# Altium schematic sheet 400W_dualConverter.SchDoc
size A4
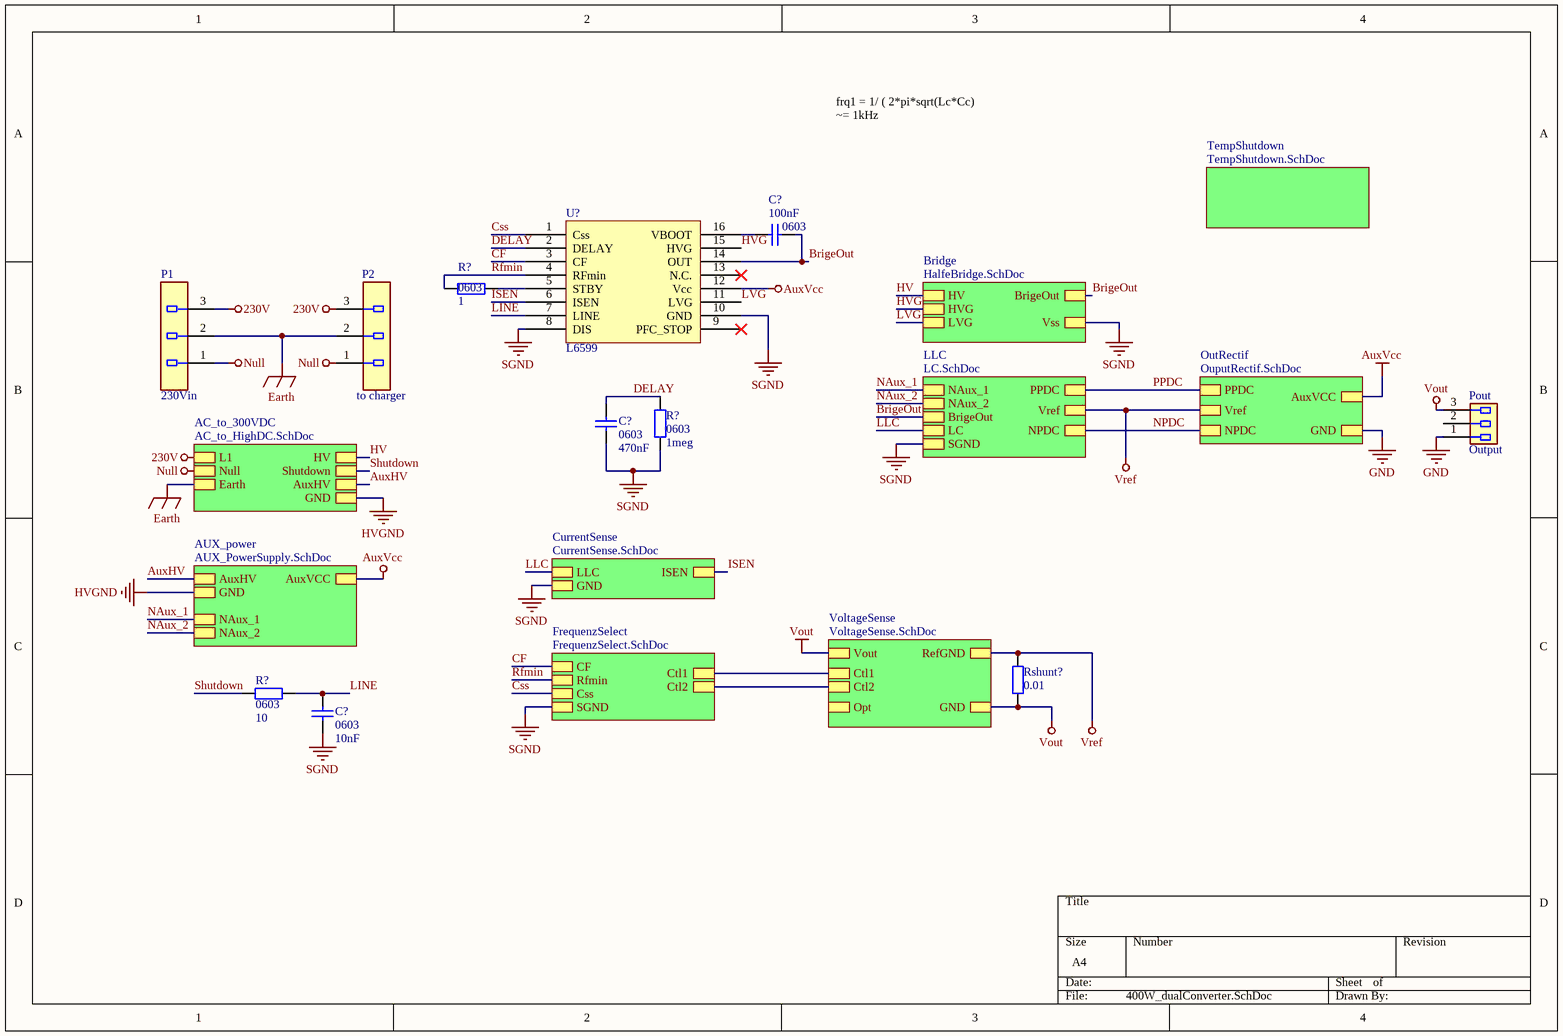
[diagram p0: 400W_dualConverter.SchDoc]

## Parts
(Parts that share a designator on the sheet are numbered #1, #2 ... from top to bottom, then left to right.)
C?#1  0603  value 100nF  [1608[0603]]
C?#2  0603  value 470nF  [1608[0603]]
C?#3  0603  value 10nF  [1608[0603]]
P1  230Vin  [IEC C14]
P2  to charger  [IEC C13 FM]
Pout  Output  [3pin, 5.08 terminal connector]
R?#1  0603  value 1  [1608[0603]]
R?#2  0603  value 1meg  [1608[0603]]
R?#3  0603  value 10  [1608[0603]]
Rshunt?  value 0.01  [1608[0603]]  (hidden comment: Res2)
U?  L6599  [SOP127P600X175-16N]

## Sub-sheets
AC_to_300VDC = AC_to_HighDC.SchDoc: L1, Null, Shutdown, HV, Earth, AuxHV, GND
AUX_power = AUX_PowerSupply.SchDoc: AuxHV, GND, NAux_1, NAux_2, AuxVCC
Bridge = HalfeBridge.SchDoc: HV, HVG, LVG, Vss, BrigeOut
CurrentSense = CurrentSense.SchDoc: LLC, GND, ISEN
FrequenzSelect = FrequenzSelect.SchDoc: CF, Rfmin, SGND, Ctl1, Ctl2, Css
LLC = LC.SchDoc: BrigeOut, LC, SGND, PPDC, NPDC, Vref, NAux_1, NAux_2
OutRectif = OuputRectif.SchDoc: PPDC, NPDC, Vref, AuxVCC, GND
TempShutdown = TempShutdown.SchDoc: no entries
VoltageSense = VoltageSense.SchDoc: GND, RefGND, Opt, Ctl2, Ctl1, Vout

## Nets
230V: P1.3 P2.3 ; sheet AC_to_300VDC/L1
AuxVcc: U?.12(Vcc) ; sheet AUX_power/AuxVCC, sheet OutRectif/AuxVCC
Earth: P1.2 P2.2 ; sheet AC_to_300VDC/Earth
GND: Pout.1 ; sheet OutRectif/GND
HVGND: sheet AC_to_300VDC/GND, sheet AUX_power/GND
Null: P1.1 P2.1 ; sheet AC_to_300VDC/Null
SGND: C?#2.1 C?#3.1 R?#2.2 U?.8(DIS) U?.10(GND) ; sheet CurrentSense/GND, sheet FrequenzSelect/SGND, sheet LLC/SGND, sheet Bridge/Vss
Vout: Pout.3 Rshunt?.1 ; sheet VoltageSense/GND, sheet VoltageSense/Vout
Vref: Rshunt?.2 ; sheet OutRectif/Vref, sheet VoltageSense/RefGND, sheet LLC/Vref
AuxHV: sheet AC_to_300VDC/AuxHV, sheet AUX_power/AuxHV
BrigeOut: C?#1.2 U?.14(OUT) ; sheet LLC/BrigeOut, sheet Bridge/BrigeOut
CF: U?.3(CF) ; sheet FrequenzSelect/CF
Css: U?.1(Css) ; sheet FrequenzSelect/Css
DELAY: C?#2.2 R?#2.1 U?.2(DELAY)
HV: sheet AC_to_300VDC/HV, sheet Bridge/HV
HVG: U?.15(HVG) ; sheet Bridge/HVG
ISEN: U?.6(ISEN) ; sheet CurrentSense/ISEN
LINE: C?#3.2 R?#3.1 U?.7(LINE)
LLC: sheet CurrentSense/LLC, sheet LLC/LC
LVG: U?.11(LVG) ; sheet Bridge/LVG
NAux_1: sheet AUX_power/NAux_1, sheet LLC/NAux_1
NAux_2: sheet AUX_power/NAux_2, sheet LLC/NAux_2
NPDC: sheet OutRectif/NPDC, sheet LLC/NPDC
PPDC: sheet OutRectif/PPDC, sheet LLC/PPDC
Rfmin: R?#1.2 U?.4(RFmin) ; sheet FrequenzSelect/Rfmin
Shutdown: R?#3.2 ; sheet AC_to_300VDC/Shutdown
NetC?#1_1: C?#1.1 U?.16(VBOOT)
NetR?#1_1: R?#1.1 U?.5(STBY)
(unnamed): sheet FrequenzSelect/Ctl1, sheet VoltageSense/Ctl1
(unnamed): sheet FrequenzSelect/Ctl2, sheet VoltageSense/Ctl2

Not connected (* = marked no-connect by the designer): Pout 2; U? 9(PFC_STOP)* 13(N.C.)*

## Notes on the sheet
- frq1 = 1/ ( 2*pi*sqrt(Lc*Cc)
  ~= 1kHz

## Library data of the parts
C?#1-C?#3 = Cap: Capacitor; Published: 8-Jun-2000; LatestRevisionDate: 17-Jul-2002; LatestRevisionNote: Re-released for DXP Platform.; PackageReference: RAD-0.3; Publisher: Altium Limited; PackageDescription: Radial Cap, Thru-Hole; 2 Leads; 0.3 in Pin Spacing; Supplier 1: Digi-Key; Supplier Part Number 1: ECQ-U2A224KL-ND
P1 P2 = IEC C14 - Male
Pout = 3pin header
R?#1-R?#3 = Res2: Resistor; Published: 8-Jun-2000; LatestRevisionDate: 17-Jul-2002; LatestRevisionNote: Re-released for DXP Platform.; PackageReference: AXIAL-0.4; Publisher: Altium Limited; PackageDescription: Axial Device, Thru-Hole; 2 Leads; 0.4 in Pin Spacing; Supplier 1: Digi-Key; Supplier Part Number 1: 541-220KFDKR-ND
Rshunt? = Res2: PMR03EZPFU10L0; Published: 8-Jun-2000; LatestRevisionDate: 17-Jul-2002; LatestRevisionNote: Re-released for DXP Platform.; PackageReference: AXIAL-0.4; Publisher: Altium Limited; PackageDescription: Axial Device, Thru-Hole; 2 Leads; 0.4 in Pin Spacing; Supplier 1: Mouser; Supplier Part Number 1: 755-PMR03EZPFU10L0